# Altium schematic sheet Hole2.SchDoc
size A
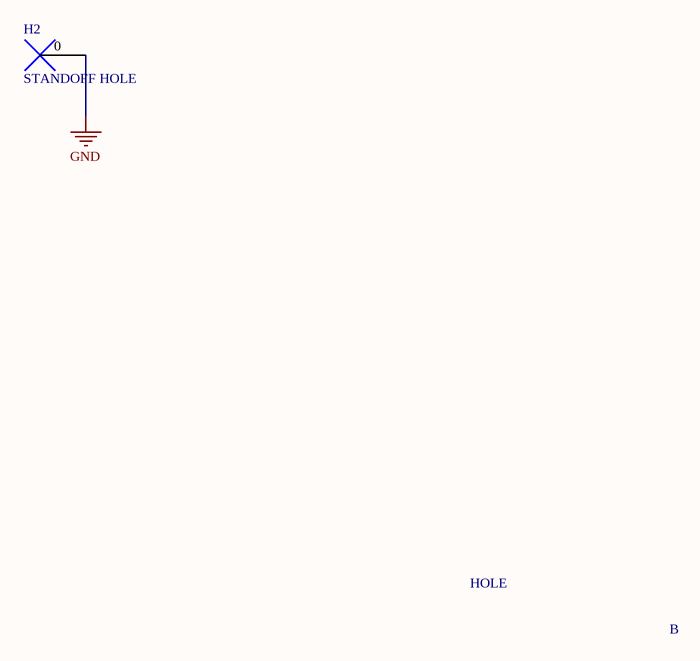
[diagram p0: Hole2.SchDoc]

## Parts
H2  STANDOFF HOLE  [HOLE_3.5MM]

## Nets
GND: H2.0

## Notes on the sheet
- HOLE
- B